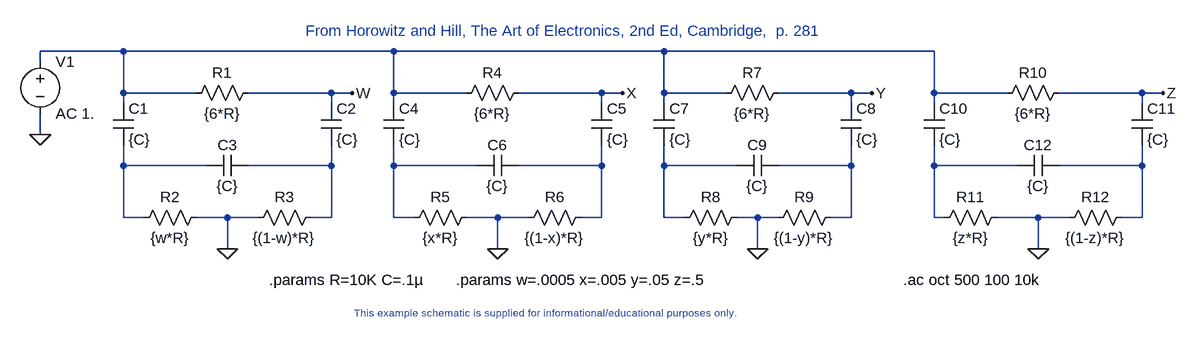
[diagram p0: schematic notch.asc]
notch.asc, the LTspice schematic file:
Version 4
SHEET 1 5945676 13421556
WIRE 1776 -496 1648 -496
WIRE 2192 -496 1776 -496
WIRE 2608 -496 2192 -496
WIRE 3024 -496 2608 -496
WIRE 1648 -480 1648 -496
WIRE 1776 -432 1776 -496
WIRE 1888 -432 1776 -432
WIRE 2096 -432 1968 -432
WIRE 2128 -432 2096 -432
WIRE 2192 -432 2192 -496
WIRE 2304 -432 2192 -432
WIRE 2512 -432 2384 -432
WIRE 2544 -432 2512 -432
WIRE 2608 -432 2608 -496
WIRE 2704 -432 2608 -432
WIRE 2896 -432 2784 -432
WIRE 2928 -432 2896 -432
WIRE 3024 -432 3024 -496
WIRE 3136 -432 3024 -432
WIRE 3344 -432 3216 -432
WIRE 3376 -432 3344 -432
WIRE 1776 -416 1776 -432
WIRE 2096 -416 2096 -432
WIRE 2192 -416 2192 -432
WIRE 2512 -416 2512 -432
WIRE 2608 -416 2608 -432
WIRE 2896 -416 2896 -432
WIRE 3024 -416 3024 -432
WIRE 3344 -416 3344 -432
WIRE 1648 -368 1648 -400
WIRE 1776 -320 1776 -352
WIRE 1904 -320 1776 -320
WIRE 2096 -320 2096 -352
WIRE 2096 -320 1968 -320
WIRE 2192 -320 2192 -352
WIRE 2320 -320 2192 -320
WIRE 2512 -320 2512 -352
WIRE 2512 -320 2384 -320
WIRE 2608 -320 2608 -352
WIRE 2720 -320 2608 -320
WIRE 2896 -320 2896 -352
WIRE 2896 -320 2784 -320
WIRE 3024 -320 3024 -352
WIRE 3152 -320 3024 -320
WIRE 3344 -320 3344 -352
WIRE 3344 -320 3216 -320
WIRE 1776 -240 1776 -320
WIRE 1808 -240 1776 -240
WIRE 1936 -240 1888 -240
WIRE 1984 -240 1936 -240
WIRE 2096 -240 2096 -320
WIRE 2096 -240 2064 -240
WIRE 2192 -240 2192 -320
WIRE 2224 -240 2192 -240
WIRE 2352 -240 2304 -240
WIRE 2400 -240 2352 -240
WIRE 2512 -240 2512 -320
WIRE 2512 -240 2480 -240
WIRE 2608 -240 2608 -320
WIRE 2640 -240 2608 -240
WIRE 2752 -240 2720 -240
WIRE 2784 -240 2752 -240
WIRE 2896 -240 2896 -320
WIRE 2896 -240 2864 -240
WIRE 3024 -240 3024 -320
WIRE 3040 -240 3024 -240
WIRE 3184 -240 3120 -240
WIRE 3232 -240 3184 -240
WIRE 3344 -240 3344 -320
WIRE 3344 -240 3312 -240
WIRE 1936 -192 1936 -240
WIRE 2352 -192 2352 -240
WIRE 2752 -192 2752 -240
WIRE 3184 -192 3184 -240
FLAG 1648 -368 0
FLAG 1936 -192 0
FLAG 2128 -432 W
FLAG 2352 -192 0
FLAG 2544 -432 X
FLAG 2752 -192 0
FLAG 2928 -432 Y
FLAG 3184 -192 0
FLAG 3376 -432 Z
SYMBOL voltage 1648 -496 R0
SYMATTR InstName V1
SYMATTR Value AC 1.
SYMBOL res 1984 -448 R90
WINDOW 0 0 56 VBottom 2
WINDOW 3 32 56 VTop 2
SYMATTR InstName R1
SYMATTR Value {6*R}
SYMBOL cap 2080 -416 R0
SYMATTR InstName C2
SYMATTR Value {C}
SYMBOL cap 1760 -416 R0
SYMATTR InstName C1
SYMATTR Value {C}
SYMBOL cap 1968 -336 R90
WINDOW 0 0 32 VBottom 2
WINDOW 3 32 32 VTop 2
SYMATTR InstName C3
SYMATTR Value {C}
SYMBOL res 1904 -256 R90
WINDOW 0 0 56 VBottom 2
WINDOW 3 32 56 VTop 2
SYMATTR InstName R2
SYMATTR Value {w*R}
SYMBOL res 2080 -256 R90
WINDOW 0 0 56 VBottom 2
WINDOW 3 32 56 VTop 2
SYMATTR InstName R3
SYMATTR Value {(1-w)*R}
SYMBOL res 2400 -448 R90
WINDOW 0 0 56 VBottom 2
WINDOW 3 32 56 VTop 2
SYMATTR InstName R4
SYMATTR Value {6*R}
SYMBOL cap 2176 -416 R0
SYMATTR InstName C4
SYMATTR Value {C}
SYMBOL cap 2496 -416 R0
SYMATTR InstName C5
SYMATTR Value {C}
SYMBOL cap 2384 -336 R90
WINDOW 0 0 32 VBottom 2
WINDOW 3 32 32 VTop 2
SYMATTR InstName C6
SYMATTR Value {C}
SYMBOL res 2320 -256 R90
WINDOW 0 0 56 VBottom 2
WINDOW 3 32 56 VTop 2
SYMATTR InstName R5
SYMATTR Value {x*R}
SYMBOL res 2496 -256 R90
WINDOW 0 0 56 VBottom 2
WINDOW 3 32 56 VTop 2
SYMATTR InstName R6
SYMATTR Value {(1-x)*R}
SYMBOL res 2800 -448 R90
WINDOW 0 0 56 VBottom 2
WINDOW 3 32 56 VTop 2
SYMATTR InstName R7
SYMATTR Value {6*R}
SYMBOL cap 2592 -416 R0
SYMATTR InstName C7
SYMATTR Value {C}
SYMBOL cap 2880 -416 R0
SYMATTR InstName C8
SYMATTR Value {C}
SYMBOL cap 2784 -336 R90
WINDOW 0 0 32 VBottom 2
WINDOW 3 32 32 VTop 2
SYMATTR InstName C9
SYMATTR Value {C}
SYMBOL res 2736 -256 R90
WINDOW 0 0 56 VBottom 2
WINDOW 3 32 56 VTop 2
SYMATTR InstName R8
SYMATTR Value {y*R}
SYMBOL res 2880 -256 R90
WINDOW 0 0 56 VBottom 2
WINDOW 3 32 56 VTop 2
SYMATTR InstName R9
SYMATTR Value {(1-y)*R}
SYMBOL res 3232 -448 R90
WINDOW 0 0 56 VBottom 2
WINDOW 3 32 56 VTop 2
SYMATTR InstName R10
SYMATTR Value {6*R}
SYMBOL cap 3008 -416 R0
SYMATTR InstName C10
SYMATTR Value {C}
SYMBOL cap 3328 -416 R0
SYMATTR InstName C11
SYMATTR Value {C}
SYMBOL cap 3216 -336 R90
WINDOW 0 0 32 VBottom 2
WINDOW 3 32 32 VTop 2
SYMATTR InstName C12
SYMATTR Value {C}
SYMBOL res 3136 -256 R90
WINDOW 0 0 56 VBottom 2
WINDOW 3 32 56 VTop 2
SYMATTR InstName R11
SYMATTR Value {z*R}
SYMBOL res 3328 -256 R90
WINDOW 0 0 56 VBottom 2
WINDOW 3 32 56 VTop 2
SYMATTR InstName R12
SYMATTR Value {(1-z)*R}
TEXT 2976 -144 Left 2 !.ac oct 500 100 10k
TEXT 2000 -144 Left 2 !.params R=10K C=.1µ
TEXT 2456 -512 Bottom 2 ;From Horowitz and Hill, The Art of Electronics, 2nd Ed, Cambridge,  p. 281
TEXT 2288 -144 Left 2 !.params w=.0005 x=.005 y=.05 z=.5
TEXT 2416 -104 Top 1 ;This example schematic is supplied for informational/educational purposes only.

The netlist it stands for:
* notch.asc
V1 N001 0 AC 1.
R1 W N001 {6*R}
C2 W N003 {C}
C1 N001 N002 {C}
C3 N003 N002 {C}
R2 0 N002 {w*R}
R3 N003 0 {(1-w)*R}
R4 X N001 {6*R}
C4 N001 N004 {C}
C5 X N005 {C}
C6 N005 N004 {C}
R5 0 N004 {x*R}
R6 N005 0 {(1-x)*R}
R7 Y N001 {6*R}
C7 N001 N006 {C}
C8 Y N007 {C}
C9 N007 N006 {C}
R8 0 N006 {y*R}
R9 N007 0 {(1-y)*R}
R10 Z N001 {6*R}
C10 N001 N008 {C}
C11 Z N009 {C}
C12 N009 N008 {C}
R11 0 N008 {z*R}
R12 N009 0 {(1-z)*R}
.ac oct 500 100 10k
.params R=10K C=.1µ
* From Horowitz and Hill, The Art of Electronics, 2nd Ed, Cambridge,  p. 281
.params w=.0005 x=.005 y=.05 z=.5
* This example schematic is supplied for informational/educational purposes only.
.backanno
.end